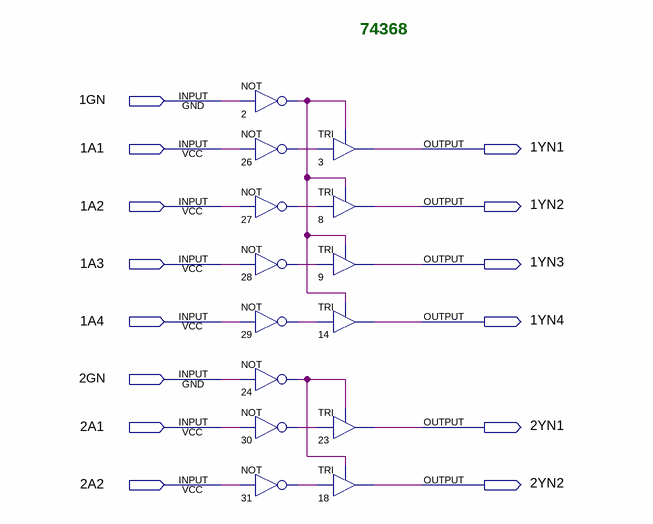
[diagram p0: schematic sheet]
// Quartus schematic 74368.bdf as structural Verilog: 14 symbols, 14 pins
module \74368  (
  input  \1GN ,
  input  \1A1 ,
  input  \1A2 ,
  input  \1A3 ,
  input  \1A4 ,
  input  \2GN ,
  input  \2A1 ,
  input  \2A2 ,
  output \1YN1 ,
  output \1YN2 ,
  output \1YN3 ,
  output \1YN4 ,
  output \2YN1 ,
  output \2YN2 
);

  wire n2_out, n24_out, n26_out, n27_out, n28_out, n29_out, n30_out, n31_out;

  not u_2 (n2_out, \1GN );
  not u_26 (n26_out, \1A1 );
  not u_27 (n27_out, \1A2 );
  not u_28 (n28_out, \1A3 );
  not u_29 (n29_out, \1A4 );
  not u_24 (n24_out, \2GN );
  not u_30 (n30_out, \2A1 );
  not u_31 (n31_out, \2A2 );
  TRI u_3 (.IN(n26_out), .OE(n2_out), .OUT(\1YN1 ));
  TRI u_8 (.IN(n27_out), .OE(n2_out), .OUT(\1YN2 ));
  TRI u_9 (.IN(n28_out), .OE(n2_out), .OUT(\1YN3 ));
  TRI u_14 (.IN(n29_out), .OE(n2_out), .OUT(\1YN4 ));
  TRI u_23 (.IN(n30_out), .OE(n24_out), .OUT(\2YN1 ));
  TRI u_18 (.IN(n31_out), .OE(n24_out), .OUT(\2YN2 ));

  // Notes on the sheet:
  //   74368
endmodule
